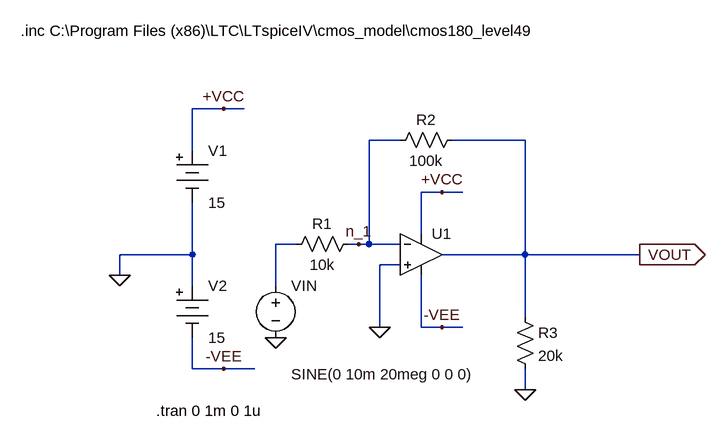
[diagram p0: schematic Draft3.asc]
Draft3.asc, the LTspice schematic file:
Version 4
SHEET 1 904 680
WIRE 128 -80 80 -80
WIRE 160 -80 128 -80
WIRE 400 -32 352 -32
WIRE 592 -32 480 -32
WIRE 80 -16 80 -80
WIRE 464 48 432 48
WIRE 496 48 464 48
WIRE 432 112 432 48
WIRE 240 128 208 128
WIRE 336 128 320 128
WIRE 352 128 352 -32
WIRE 352 128 336 128
WIRE 400 128 352 128
WIRE 80 144 80 64
WIRE 80 144 -32 144
WIRE 592 144 592 -32
WIRE 592 144 464 144
WIRE 768 144 592 144
WIRE 400 160 368 160
WIRE -32 176 -32 144
WIRE 80 192 80 144
WIRE 208 192 208 128
WIRE 592 240 592 144
WIRE 368 256 368 160
WIRE 432 256 432 176
WIRE 464 256 432 256
WIRE 496 256 464 256
WIRE 80 320 80 272
WIRE 128 320 80 320
WIRE 176 320 128 320
WIRE 592 352 592 320
FLAG -32 176 0
FLAG 128 -80 +VCC
FLAG 128 320 -VEE
FLAG 368 256 0
FLAG 464 48 +VCC
FLAG 464 256 -VEE
FLAG 208 272 0
FLAG 768 144 VOUT
IOPIN 768 144 Out
FLAG 592 352 0
FLAG 336 128 n_1
SYMBOL Misc\\battery 80 -32 R0
WINDOW 123 0 0 Left 2
WINDOW 39 0 0 Left 2
SYMATTR InstName V1
SYMATTR Value 15
SYMBOL Misc\\battery 80 176 R0
WINDOW 123 0 0 Left 2
WINDOW 39 0 0 Left 2
SYMATTR InstName V2
SYMATTR Value 15
SYMBOL res 336 112 R90
WINDOW 0 0 56 VBottom 2
WINDOW 3 32 56 VTop 2
SYMATTR InstName R1
SYMATTR Value 10k
SYMBOL res 496 -48 R90
WINDOW 0 0 56 VBottom 2
WINDOW 3 32 56 VTop 2
SYMATTR InstName R2
SYMATTR Value 100k
SYMBOL res 576 224 R0
SYMATTR InstName R3
SYMATTR Value 20k
SYMBOL voltage 208 176 R0
WINDOW 3 24 152 Left 2
WINDOW 39 0 0 Left 2
SYMATTR InstName VIN
SYMATTR Value SINE(0 10m 20meg 0 0 0)
SYMATTR Value2 AC 0 0
SYMBOL Opamps\\UniversalOpamp2 432 144 R0
SYMATTR InstName U1
TEXT 24 384 Left 2 !.tran 0 1m 0 1u
TEXT -184 -200 Left 2 !.inc C:\\Program Files (x86)\\LTC\\LTspiceIV\\cmos_model\\cmos180_level49

The netlist it stands for:
* Draft3.asc
V1 +VCC 0 15
V2 0 -VEE 15
R1 n_1 N001 10k
R2 VOUT n_1 100k
R3 VOUT 0 20k
VIN N001 0 SINE(0 10m 20meg 0 0 0) AC 0 0
XU1 0 n_1 +VCC -VEE VOUT level.2 Avol=1Meg GBW=10Meg Slew=10Meg ilimit=25m rail=0 Vos=0 phimargin=45 en=0 enk=0 in=0 ink=0 Rin=500Meg  ; pins IN+ IN- V+ V- OUT
.tran 0 1m 0 1u
.inc C:\Program Files (x86)\LTC\LTspiceIV\cmos_model\cmos180_level49
.lib UniversalOpamps2.sub
.backanno
.end

* Results of the author's LTspice run, read from the files saved beside the schematic
* Operating Point, zero values left out:
*   V(+vcc) = 15 V
*   V(-vee) = -15 V
*   I(V2) = -1.498 mA
*   I(V1) = -1.498 mA
*   Ix(u1:3) = 1.498 mA
*   Ix(u1:4) = -1.498 mA